# Altium project Safety.PrjPCB
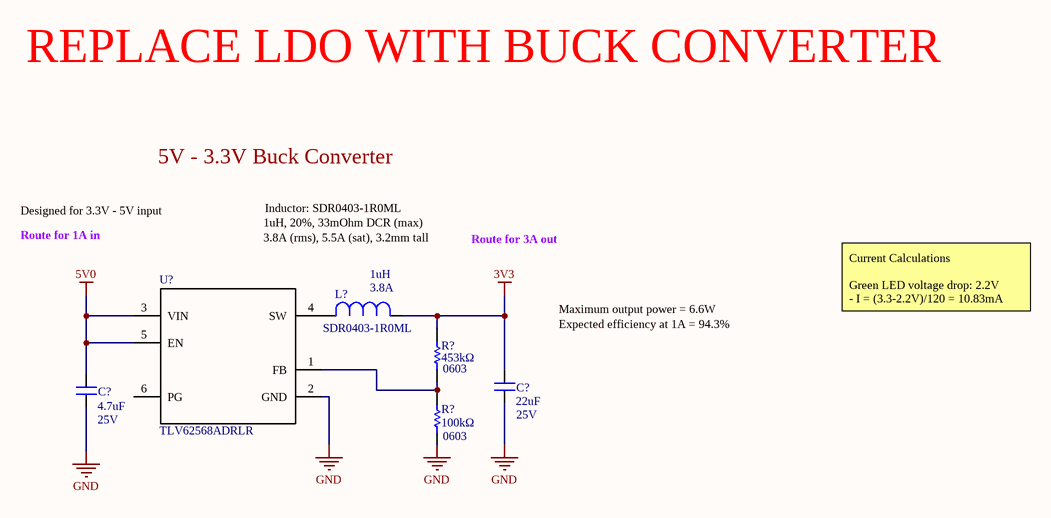
[diagram p0: SH1 - POWER.SchDoc]
Address1: 200 University Avenue; Address2: Waterloo; Address3: Ontario; Address4: Canada N2L 3G6; BoardName: Your Board Name; DrawnBy: Your Name
6 sheets, 103 parts. Net scope: flat (ports and power ports of the same name join across sheets).
Sheets:
  SH1 - POWER.SchDoc
  SH2 - CONNECTORS.SchDoc
  SH3 - OPAMPS.SchDoc
  SH4 - DIFFERENTIAL I2C.SchDoc
  SH5 - MICROCONTROLLER.SchDoc
  SH6 - CAN.SchDoc

## Sheet SH1 - POWER.SchDoc: Power
size Letter; DrawnBy: Qinyang Bao, Nicole Rosario; Organization: UW Robotics; Address1: 200 University Avenue; Address2: Waterloo; Address3: Ontario; Address4: Canada N2L 3G6

### Parts
(Parts that share a designator on the sheet are numbered #1, #2 ... from top to bottom, then left to right.)
C?#1  Voltage: 25V  Capacitance: 22uF  [CAPC3225X270N]  (hidden comment: GRM32ER71E226ME15K)
C?#2  value 4.7uF  Voltage Rating: 25V  [CAPC3225X280N]  (hidden comment: CAP_4.7uF_25V_1210)
L?  value 1uH  Manufacturer Part Number 1: SDR0403-1R0ML  Current Rating: 3.8A  [IND_BOURNS_SDR04]  (hidden comment: IND_1uH_3.8A)
R?#1  value 453kΩ  Package: 0603  [RESC0603(1608)_N]  (hidden comment: RES_453kΩ_0603)
R?#2  value 100kΩ  Package: 0603  [RESC0603(1608)_N]  (hidden comment: RES_100kΩ_0603_1%)
U?#1  TLV62568ADRLR  [SOT50P160X60-6N]

### Nets
3V3: C?#1.2 L?.2 R?#1.2
5V0: C?#2.2 U?#1.3(VIN) U?#1.5(EN)
GND: C?#1.1 C?#2.1 R?#2.1 U?#1.2(GND)
NetL?_1: L?.1 U?#1.4(SW)
NetR?#1_1: R?#1.1 R?#2.2 U?#1.1(FB)

Not connected (* = marked no-connect by the designer): U?#1 6(PG)

### Notes on the sheet
- REPLACE LDO WITH BUCK CONVERTER
- 5V - 3.3V Buck Converter
- Designed for 3.3V - 5V input
- Route for 1A in
- 1uH, 20%, 33mOhm DCR (max)
- 3.8A (rms), 5.5A (sat), 3.2mm tall
- Inductor: SDR0403-1R0ML
- Route for 3A out
- Current Calculations
  Green LED voltage drop: 2.2V
  - I = (3.3-2.2V)/120 = 10.83mA
- Maximum output power = 6.6W
- Expected efficiency at 1A = 94.3%
- Title
- Size:
- Date:
- Letter
- Drawn By:
- Sheet
- of
- File:

### Library data of the parts
C?#1 = GRM32ER71E226ME15K: CAP CER 22UF 25V X7R 1210; Manufacturer 1: Murata Electronics; Tolerance: ±20%; Manufacturer Part Number 1: GRM32ER71E226ME15K; Supplier 1: Digi-Key; Supplier Part Number 1: 490-14682-1-ND; Package: 1210 (3225 Metric)
C?#2 = CAP_4.7uF_25V_1210: CAP CER 4.7UF 25V X8L 1210; Manufacturer Part Number 1: GCJ32EL81E475KA01L; Manufacturer 1: Murata Electronics; Tolerance: 10%; Supplier Part Number 1: 490-16465-1-ND; Supplier 1: Digi-Key; Mount: Surface Mount; Case/Package: 1210; Case Code (Metric): 3225; Case Code (Imperial): 1210; Min Operating Temperature: -55°C; Max Operating Temperature: 150°C; Capacitance: 4.7uF
L? = IND_1uH_3.8A: FIXED IND 1UH 3.8A 33 MOHM SMD; Manufacturer 1: Bourns Inc.; Tolerance: ±20%; Supplier Part Number 1: SDR0403-1R0MLCT-ND; Supplier 1: Digi-Key
R?#1 = RES_453kΩ_0603: RES SMD 453K OHM 1% 1/10W 0603; Manufacturer 1: Panasonic Electronic Components; Manufacturer Part Number 1: ERJ-3EKF4533V; Dimensions: 0.063" L x 0.031" W (1.60mm x 0.80mm); Supplier Part Number 1: P453KHCT-ND; Supplier 1: Digi-Key; Mount: Surface Mount; Case Code (Metric): 1608; Tolerance: 1%; Case/Package: 0603
R?#2 = RES_100kΩ_0603_1%: RES SMD 100K OHM 1% 1/10W 0603; Manufacturer 1: Yageo; Manufacturer Part Number 1: RC0603FR-07100KL; Dimensions: 0.063" L x 0.031" W (1.60mm x 0.80mm); Supplier Part Number 1: 311-100KHRCT-ND; Supplier 1: Digi-Key; Mount: Surface Mount; Case Code (Metric): 1608; Tolerance: 1%; Case/Package: 0603
U?#1 = TLV62568ADRLR: IC REG BUCK ADJUSTABLE 2A SOT563; Manufacturer 1: Texas Instruments; Vin (Min): 2.5V; Vin (Max): 5.5V; Vout (Min/Fixed): 0.6V; Iout: 1A; Switching Frequency: 1.5MHz; Manufacturer Part Number 1: TLV62568ADRLR; Supplier 1: Digi-Key; Supplier Part Number 1: 296-50407-1-ND; Vout (Max): 5.5V; Package: SOT-563, SOT-666; Iout (Max): 2A

## Sheet SH2 - CONNECTORS.SchDoc: Connectors
size Letter; DrawnBy: Qinyang Bao, Nicole Rosario; Organization: UW Robotics; Address1: 200 University Avenue; Address2: Waterloo; Address3: Ontario; Address4: Canada N2L 3G6
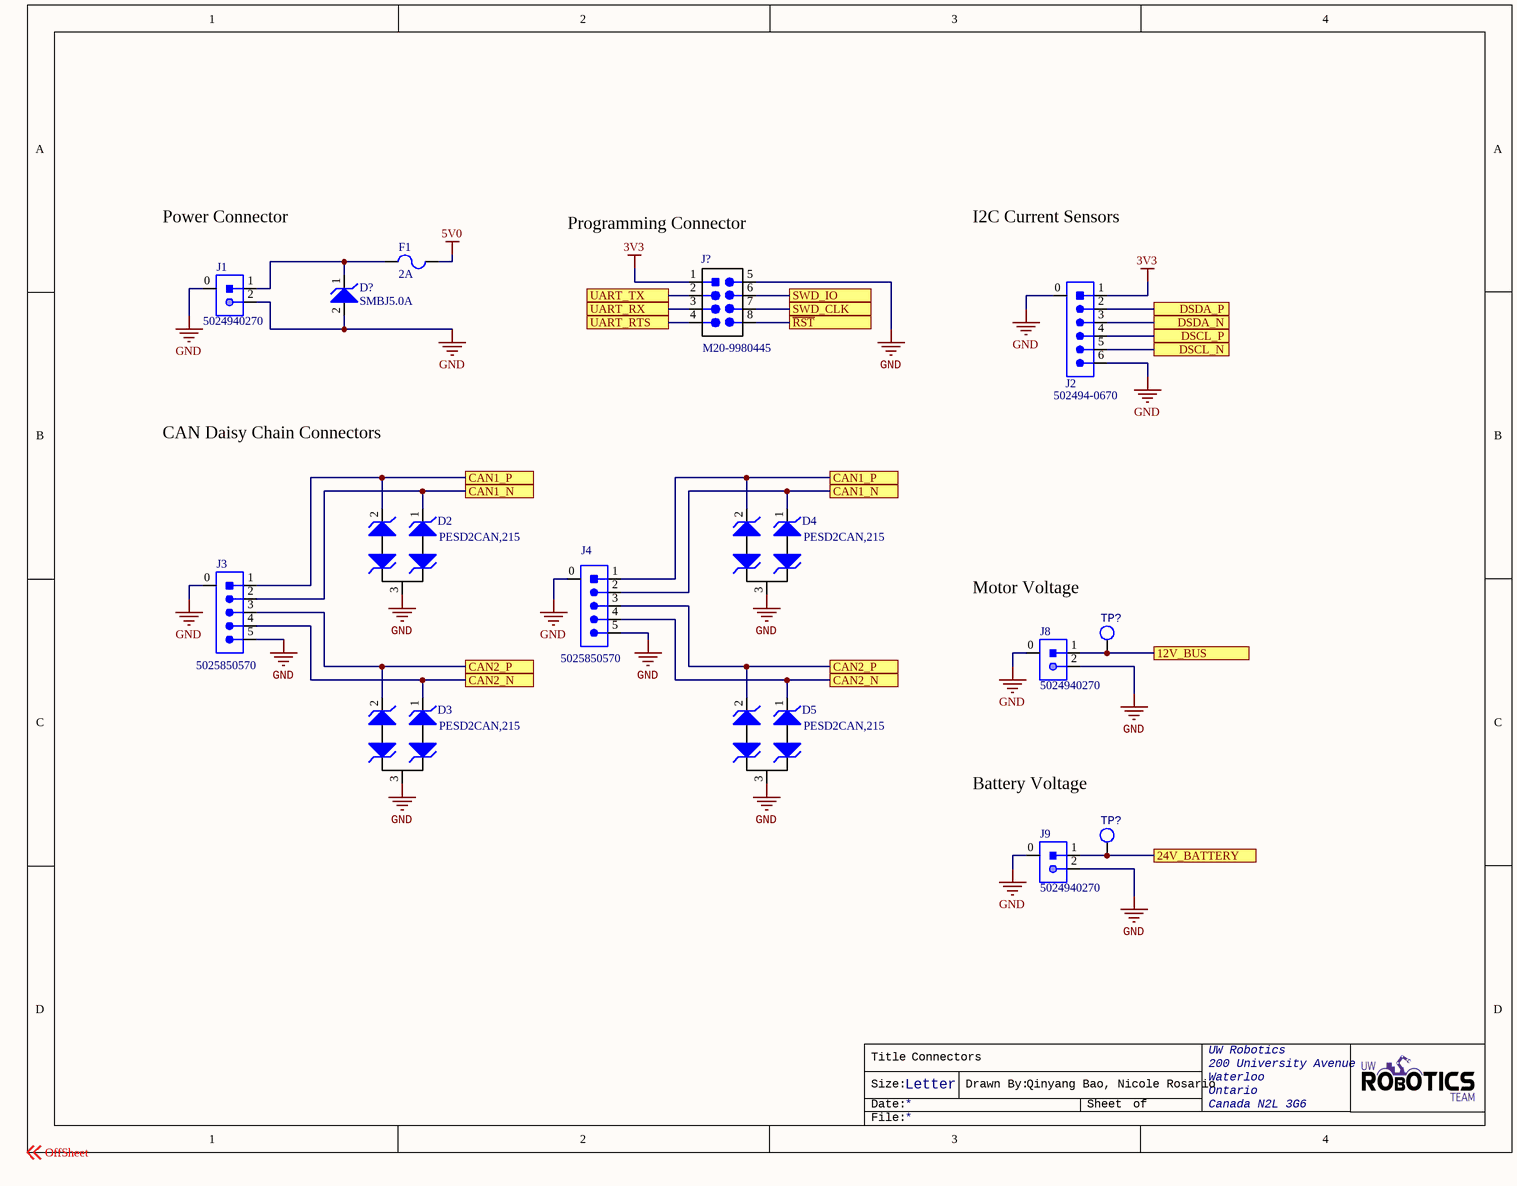
[diagram p1: SH2 - CONNECTORS.SchDoc]

### Parts
(Parts that share a designator on the sheet are numbered #1, #2 ... from top to bottom, then left to right.)
D2  Manufacturer Part Number: PESD2CAN,215  [NXP-SOT323-3]  (hidden comment: TVS_DIODE_CAN)
D3  Manufacturer Part Number: PESD2CAN,215  [NXP-SOT323-3]  (hidden comment: TVS_DIODE_CAN)
D4  Manufacturer Part Number: PESD2CAN,215  [NXP-SOT323-3]  (hidden comment: TVS_DIODE_CAN)
D5  Manufacturer Part Number: PESD2CAN,215  [NXP-SOT323-3]  (hidden comment: TVS_DIODE_CAN)
D?  Manufacturer Part Number 1: SMBJ5.0A  [TVS_DIODE_BIDIRECTIONAL]  (hidden comment: TVS_DIODE_UNIDIR_5V)
F1  Current Rating: 2A  [FUSE_0603]  (hidden comment: FUSE_2A_0603)
J1  Manufacturer Part Number 1: 5024940270  [MOLEX-5024940270]
J2  Manufacturer Part Number 1: 502494-0670  [MOLEX-5024940670]
J3  Manufacturer Part Number 1: 5025850570  [MOLEX-5025850570]
J4  Manufacturer Part Number 1: 5025850570  [MOLEX-5025850570]
J8  Manufacturer Part Number 1: 5024940270  [MOLEX-5024940270]
J9  Manufacturer Part Number 1: 5024940270  [MOLEX-5024940270]
J?  Manufacturer Part Number 1: M20-9980445  [HEADER_2X4]  (hidden comment: HEADER 4X2)
TP?#1  TESTPOINT_LOOP  [TESTPOINT_LOOP]  (value not drawn)
TP?#2  TESTPOINT_LOOP  [TESTPOINT_LOOP]  (value not drawn)

### Ports
12V_BUS, 24V_BATTERY, CAN1_N, CAN1_P, CAN2_N, CAN2_P, DSCL_N, DSCL_P, DSDA_N, DSDA_P, SWD_CLK, SWD_IO, UART_RTS, UART_RX, UART_TX, ~{RST}

### Nets
3V3: J2.1 J?.1(VCC)
5V0: F1.2
GND: D2.3 D3.3 D4.3 D5.3 D?.2 J1.0 J1.2 J2.0 J2.6 J3.0 J3.5 J4.0 J4.5 J8.0 J8.2 J9.0 J9.2 J?.5(GND)
BIAS_GND: J2.3 ; port DSDA_N
DSCL_N: J2.5 ; port DSCL_N
DSCL_P: J2.4 ; port DSCL_P
DSDA_P: J2.2 ; port DSDA_P
NetC5_2: J?.8 ; port ~{RST}
NetC?#3_2: D2.1 D4.1 J3.2 J4.2 ; port CAN1_N
NetC?#4_2: D2.2 D4.2 J3.1 J4.1 ; port CAN1_P
NetC?#6_2: D3.1 D5.1 J3.4 J4.4 ; port CAN2_N
NetC?#7_2: D3.2 D5.2 J3.3 J4.3 ; port CAN2_P
NetD?_1: D?.1 F1.1 J1.1
NetJ8_1: J8.1 TP?#1.1 ; port 12V_BUS
NetJ9_1: J9.1 TP?#2.1 ; port 24V_BATTERY
NetJ?_2: J?.2 ; port UART_TX
NetJ?_3: J?.3 ; port UART_RX
NetJ?_4: J?.4 ; port UART_RTS
NetJ?_6: J?.6 ; port SWD_IO
NetJ?_7: J?.7 ; port SWD_CLK

### Notes on the sheet
- Power Connector
- (near J?) Programming Connector
- I2C Current Sensors
- CAN Daisy Chain Connectors
- Motor Voltage
- Battery Voltage
- Labels drawn without touching a wire or pin: OffSheet
- Title
- Size:
- Date:
- Letter
- Drawn By:
- Sheet
- of
- File:

### Library data of the parts
D2-D5 = TVS_DIODE_CAN: TVS DIODE 24V 41V SOT323-3; Manufacturer: Nexperia USA Inc.; Package: SC-70, SOT-323; ComponentLink1Description: Datasheet; ComponentLink1URL: https://assets.nexperia.com/documents/data-sheet/PESD1CAN-U.pdf; Supplier Part Number 1: 1727-3891-1-ND; Supplier 1: Digi-Key
D? = TVS_DIODE_UNIDIR_5V: TVS DIODE 5V 9.2V DO214AA; Manufacturer 1: Littelfuse; Max Power Dissipation: 600W; Polarity: Unidirectional; Number of Elements: 1; Leakage Current: 800uA; Reverse Breakdown Voltage: 6.4V; Max Surge Current: 65.3A; Max Breakdown Voltage: 7V; Test Current: 10mA; Element Configuration: Single; Power Line Protection: No; Current: 68A; ESD Protection: Yes; ComponentLink1Description: Datasheet; ComponentLink1URL: https://www.littelfuse.com/~/media/electronics/datasheets/tvs_diodes/littelfuse_tvs_diode_smbj_datasheet.pdf.pdf; Supplier 1: Digi-Key; Stock 1: 14825; Pricing 1: 1=0.41000, 10=0.30500, 25=0.27520, 100=0.14500, 250=0.14352, 500=0.12850, 1000=0.10000 (USD); RoHS: Yes; Mount: Surface Mount; Case/Package: SMB; Number of Pins: 2; Min Operating Temperature: -55°C; Max Operating Temperature: 150°C; Packaging: Tape and Reel; Package Quantity: 3000; Power Dissipation: 600W; Direction: Unidirectional; Reverse Standoff Voltage: 5V; Min Breakdown Voltage: 6.4V; Clamping Voltage: 9.2V; Peak Pulse Power: 600W; Breakdown Voltage: 6.4V; Termination: SMD/SMT; Peak Pulse Current: 65.3A; Number of Channels: 1; Max Reverse Leakage Current: 800uA; Operating Supply Voltage: 5V; Number of Unidirectional Channels: 1; Composition: Zener; Voltage Rating (DC): 5V; Voltage: 5V; Length: 0.179inch; Height: 0.096inch; Width: 0.155inch; Radiation Hardening: No; REACH SVHC: Unknown; Lead Free: Lead Free; ComponentLink2URL: https://datasheet.ciiva.com/25624/0900766b810f4eeb-25624712.pdf?src-supplier=RSComponents; ComponentLink2Description: https://datasheet.ciiva.com/25624/0900766b810f4eeb-25624712.pdf?src-supplier=RSComponents; ComponentLink3URL: https://datasheet.ciiva.com/34302/1546929-34302459.pdf?src-supplier=Jameco; ComponentLink3Description: https://datasheet.ciiva.com/34302/1546929-34302459.pdf?src-supplier=Jameco; ComponentLink4URL: https://datasheet.ciiva.com/46381/1677318-46381958.pdf?src-supplier=Element14; ComponentLink4Description: https://datasheet.ciiva.com/46381/1677318-46381958.pdf?src-supplier=Element14; ComponentLink5URL: https://datasheet.ciiva.com/331/littelfuse-tvs-diode-smbj-datasheet-pdf-331131.pdf?src-supplier=Digi-Key; ComponentLink5Description: https://datasheet.ciiva.com/331/littelfuse-tvs-diode-smbj-datasheet-pdf-331131.pdf?src-supplier=Digi-Key; ComponentLink6URL: https://datasheet.ciiva.com/331/littelfuse-tvs-diode-smbj-datasheet-pdf-331132.pdf?src-supplier=Digi-Key; ComponentLink6Description: https://datasheet.ciiva.com/331/littelfuse-tvs-diode-smbj-datasheet-pdf-331132.pdf?src-supplier=Digi-Key; ComponentLink7URL: https://datasheet.ciiva.com/331/littelfuse-tvs-diode-smbj-datasheet-pdf-331133.pdf?src-supplier=Digi-Key; ComponentLink7Description: https://datasheet.ciiva.com/331/littelfuse-tvs-diode-smbj-datasheet-pdf-331133.pdf?src-supplier=Digi-Key; Supplier Part Number 1: SMBJ5.0ALFCT-ND
F1 = FUSE_2A_0603: FUSE SMD 2A 32V; ComponentLink1URL: https://datasheet.ciiva.com/303/467-303400.pdf?src-supplier=Digi-Key; ComponentLink1Description: https://datasheet.ciiva.com/303/467-303400.pdf?src-supplier=Digi-Key; ComponentLink2URL: http://datasheet.octopart.com/0467002.NRHF-Littelfuse-datasheet-32023482.pdf?src-supplier=Future+Electronics; ComponentLink2Description: http://datasheet.octopart.com/0467002.NRHF-Littelfuse-datasheet-32023482.pdf?src-supplier=Future+Electronics; ComponentLink3URL: http://datasheet.octopart.com/0467002.NRHF-Littelfuse-datasheet-136509808.pdf?src-supplier=Future+Electronics; ComponentLink3Description: http://datasheet.octopart.com/0467002.NRHF-Littelfuse-datasheet-136509808.pdf?src-supplier=Future+Electronics; Mount: Surface Mount; Voltage Rating (AC): 32V; Voltage Rating (DC): 32V; Supplier 1: Digi-Key; Supplier Part Number 1: F7132CT-ND; Supplier Packaging 1: Cut Tape
J1 J8 J9 = CON_2M_SM_RA: CONN HEADER SMD RIGHT ANGLE 2MM PITCH; Manufacturer 1: Molex; Connector Type: Receptacle,Forked; Number of Positions: 2; Supplier 1: Digi-Key; Stock 1: 3397; Pricing 1: 1=0.53000, 10=0.49400, 25=0.44440, 50=0.39500, 100=0.37850, 250=0.34556 (USD); RoHS: No; Mount: Surface Mount; Contact Plating: Tin; Insulation Color: Natural; Insulation Material: Resin; Min Operating Temperature: -40°C; Max Operating Temperature: 105°C; Fastening Type: Latch; Packaging: Tape and Reel; Number of Rows: 1; Termination: Solder; Flammability Rating: UL94 V-0; ComponentLink1URL: https://www.molex.com/pdm_docs/as/AS-502439-002-001.pdf?src-supplier=Digi-Key; ComponentLink1Description: https://www.molex.com/pdm_docs/as/AS-502439-002-001.pdf?src-supplier=Digi-Key; Supplier Part Number 1: WM15810CT-ND
J2 = CON_6M_SM_RA: CONN HEADER SMD RIGHT ANGLE 2MM PITCH; Manufacturer 1: Molex; Insulation Resistance: 1GR; Current Rating: 3A; Voltage Rating: 250V; Connector Type: Receptacle,Forked; Number of Positions: 6; Gender: Receptacle; Glow Wire Compliant: Non-compliant; Supplier 1: Digi-Key; Stock 1: 7093; Pricing 1: 1=0.81000, 10=0.70800, 25=0.66680, 50=0.63880, 100=0.61110, 250=0.55552 (USD); RoHS: Yes; Mount: Surface Mount; Material: Polybutylene; Color: Natural; Housing Material: PBT; Housing Color: Natural; Contact Plating: Tin; Contact Material: Copper Alloy; Min Operating Temperature: -25°C; Max Operating Temperature: 85°C; Package Quantity: 950; Number of Rows: 1; Fastening Type: Latch; Packaging: Tape and Reel; Termination: Solder; Number of Contacts: 6; Orientation: Right Angle; Number of Circuits: 6; Contact Gender: Female; Max Voltage Rating (AC): 250V; Max Voltage Rating (DC): 250V; Length: 16mm; Pitch: 2mm; Depth: 6.85mm; Radiation Hardening: No; REACH SVHC: Unknown; Flammability Rating: UL94 V-0; ComponentLink1URL: https://datasheet.ciiva.com/755/5024940670-sd-755844.pdf?src-supplier=Digi-Key; ComponentLink1Description: https://datasheet.ciiva.com/755/5024940670-sd-755844.pdf?src-supplier=Digi-Key; ComponentLink2URL: https://datasheet.ciiva.com/24467/101355024940670-pcb-receptacles-24467588.pdf?src-supplier=Onlinecomponents.com; ComponentLink2Description: https://datasheet.ciiva.com/24467/101355024940670-pcb-receptacles-24467588.pdf?src-supplier=Onlinecomponents.com; ComponentLink3URL: https://datasheet.ciiva.com/16656/5024940670-pcb-receptacles-16656439.pdf?src-supplier=Avnet+Europe; ComponentLink3Description: https://datasheet.ciiva.com/16656/5024940670-pcb-receptacles-16656439.pdf?src-supplier=Avnet+Europe; ComponentLink4URL: https://datasheet.ciiva.com/7436/1630854-7436283.pdf?src-supplier=Newark; ComponentLink4Description: https://datasheet.ciiva.com/7436/1630854-7436283.pdf?src-supplier=Newark; ComponentLink5URL: https://datasheet.ciiva.com/5157/5024940670-pcb-receptacles-179322-5157180.pdf?src-supplier=Mouser; ComponentLink5Description: https://datasheet.ciiva.com/5157/5024940670-pcb-receptacles-179322-5157180.pdf?src-supplier=Mouser; ComponentLink6URL: https://datasheet.ciiva.com/7917/1630854-7917014.pdf?src-supplier=Element14; ComponentLink6Description: https://datasheet.ciiva.com/7917/1630854-7917014.pdf?src-supplier=Element14; ComponentLink7URL: https://datasheet.ciiva.com/30242/101355024940670-pcb-receptacles-30242550.pdf?src-supplier=Onlinecomponents.com; ComponentLink7Description: https://datasheet.ciiva.com/30242/101355024940670-pcb-receptacles-30242550.pdf?src-supplier=Onlinecomponents.com; ComponentLink8URL: https://datasheet.ciiva.com/755/5024940670-sd-755789.pdf?src-supplier=Digi-Key; ComponentLink8Description: https://datasheet.ciiva.com/755/5024940670-sd-755789.pdf?src-supplier=Digi-Key; Supplier Part Number 1: WM2283CT-ND
J3 J4 = CON_5M_SM_RA: CONN HEADER SMD RIGHT ANGLE 1.5MM PITCH; Manufacturer 1: Molex; Connector Type: Receptacle,Center Strip Contact; Number of Positions: 5; Current Rating: 2A; Supplier 1: Digi-Key; Stock 1: 2875; RoHS: Yes; Mount: Surface Mount; Termination: Solder; Number of Contacts: 5; Orientation: Right Angle; Number of Circuits: 5; Number of Rows: 1; Supplier Part Number 1: WM14469CT-ND
J? = HEADER 4X2: CONN HEADER VERT 8POS 2.54MM; Manufacturer 1: Harwin Inc.; Supplier Part Number 1: 952-2122-ND; Supplier 1: Digi-Key
TP?#1 TP?#2 = TESTPOINT_LOOP: Loop testpoint through-hole pad; Manufacturer: Keystone Electronics; Manufacturer Part Number 1: 5002; Supplier Part Number 1: 36-5002-ND; Supplier 1: Digi-Key

## Sheet SH3 - OPAMPS.SchDoc: Safety - Opamps
size Letter; DrawnBy: Qinyang Bao, Kyle Hong; Organization: UW Robotics; Address1: 200 University Avenue; Address2: Waterloo; Address3: Ontario; Address4: Canada N2L 3G6
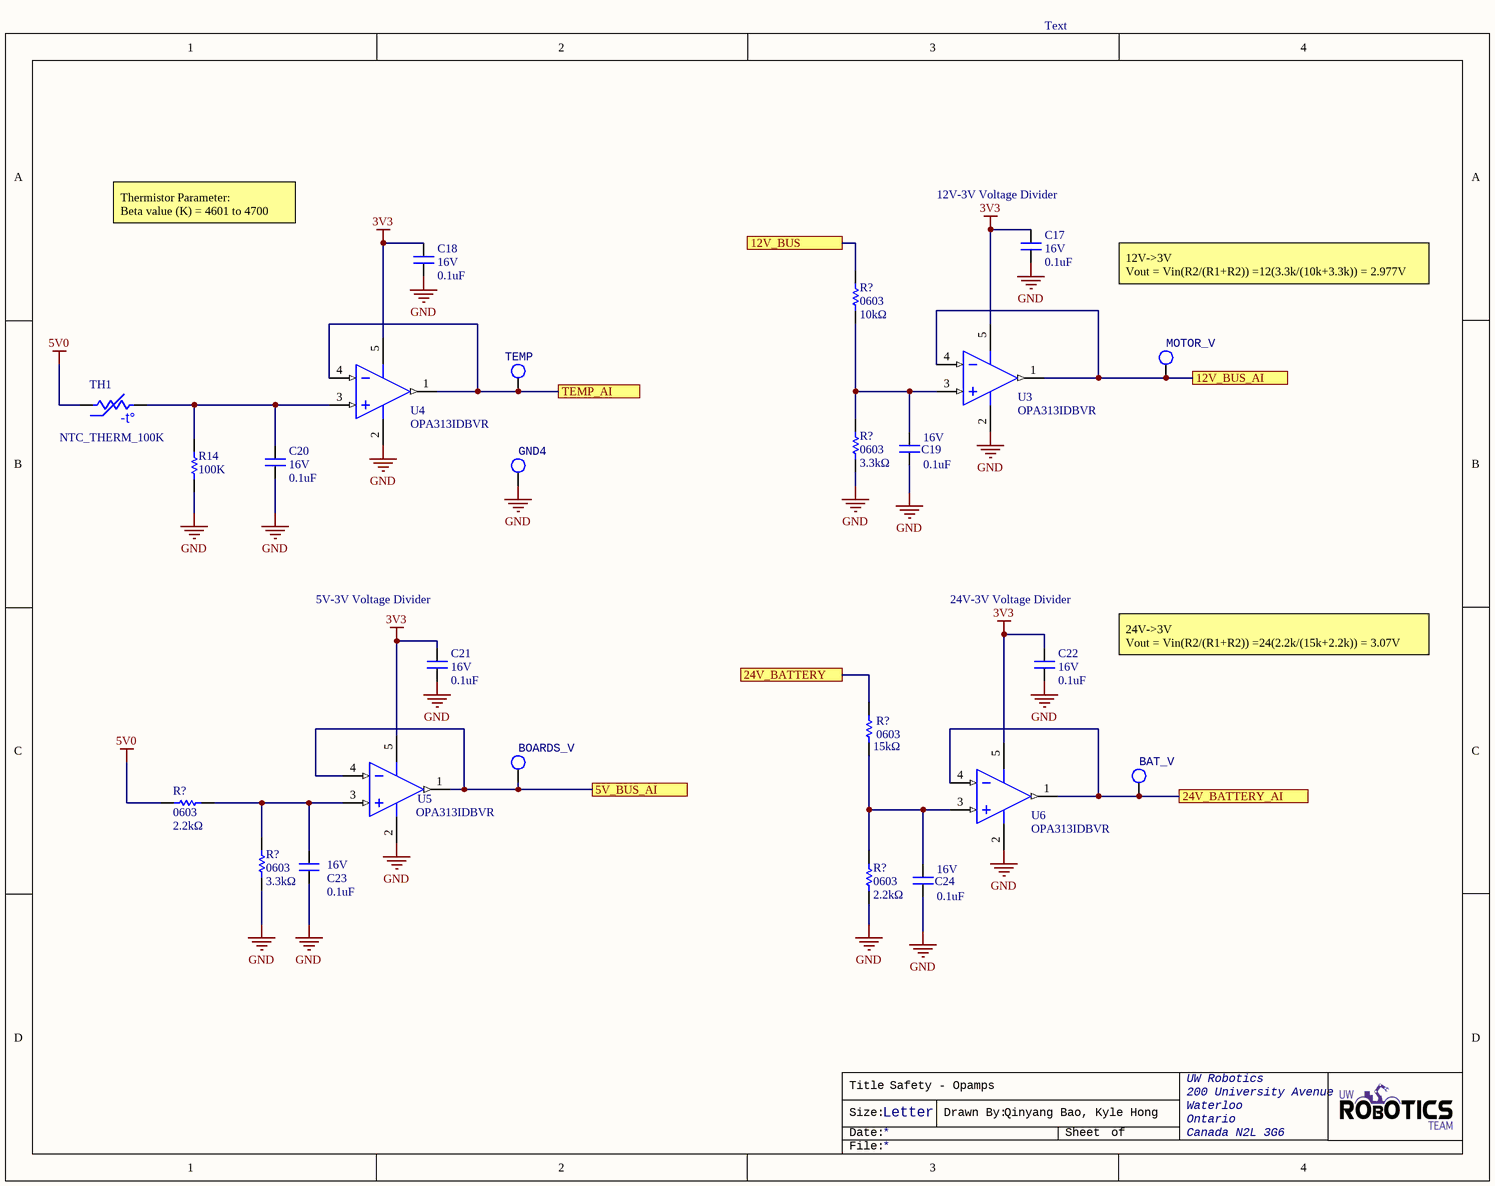
[diagram p2: SH3 - OPAMPS.SchDoc]

### Parts
(Parts that share a designator on the sheet are numbered #1, #2 ... from top to bottom, then left to right.)
BAT_V  TESTPOINT_LOOP  [TESTPOINT_LOOP]  (value not drawn)
BOARDS_V  TESTPOINT_LOOP  [TESTPOINT_LOOP]  (value not drawn)
C17  value 0.1uF  Voltage Rating: 16V  [CAPC0603(1608)55_N]  (hidden comment: CAP_0.1uF_16V_0603)
C18  value 0.1uF  Voltage Rating: 16V  [CAPC0603(1608)55_N]  (hidden comment: CAP_0.1uF_16V_0603)
C19  value 0.1uF  Voltage Rating: 16V  [CAPC0603(1608)55_N]  (hidden comment: CAP_0.1uF_16V_0603)
C20  value 0.1uF  Voltage Rating: 16V  [CAPC0603(1608)55_N]  (hidden comment: CAP_0.1uF_16V_0603)
C21  value 0.1uF  Voltage Rating: 16V  [CAPC0603(1608)55_N]  (hidden comment: CAP_0.1uF_16V_0603)
C22  value 0.1uF  Voltage Rating: 16V  [CAPC0603(1608)55_N]  (hidden comment: CAP_0.1uF_16V_0603)
C23  value 0.1uF  Voltage Rating: 16V  [CAPC0603(1608)55_N]  (hidden comment: CAP_0.1uF_16V_0603)
C24  value 0.1uF  Voltage Rating: 16V  [CAPC0603(1608)55_N]  (hidden comment: CAP_0.1uF_16V_0603)
GND4  TESTPOINT_LOOP  [TESTPOINT_LOOP]  (value not drawn)
MOTOR_V  TESTPOINT_LOOP  [TESTPOINT_LOOP]  (value not drawn)
R14  value 100K  [RESC0603(1608)_N]  (hidden comment: RES_100K_0603)
R?#3  value 10kΩ  Case Code (Imperial): 0603  [RESC0603(1608)_N]  (hidden comment: RES_10kΩ_0603)
R?#4  value 3.3kΩ  Case Code (Imperial): 0603  [RESC0603(1608)_N]  (hidden comment: RES_3.3kΩ_0603)
R?#5  value 15kΩ  Case Code (Imperial): 0603  [RESC0603(1608)_N]  (hidden comment: RES_15kΩ_0603)
R?#6  value 2.2kΩ  Case Code (Imperial): 0603  [RESC0603(1608)_N]  (hidden comment: RES_2.2kΩ_0603)
R?#7  value 3.3kΩ  Case Code (Imperial): 0603  [RESC0603(1608)_N]  (hidden comment: RES_3.3kΩ_0603)
R?#8  value 2.2kΩ  Case Code (Imperial): 0603  [RESC0603(1608)_N]  (hidden comment: RES_2.2kΩ_0603)
TEMP  TESTPOINT_LOOP  [TESTPOINT_LOOP]  (value not drawn)
TH1  NTC_THERM_100K  [RESC0603(1608)_N]
U3  OPA313IDBVR  [DBV0005A_M]
U4  OPA313IDBVR  [DBV0005A_M]
U5  OPA313IDBVR  [DBV0005A_M]
U6  OPA313IDBVR  [DBV0005A_M]

### Ports
5V_BUS_AI, 12V_BUS, 12V_BUS_AI, 24V_BATTERY, 24V_BATTERY_AI, TEMP_AI

### Nets
3V3: C17.2 C18.1 C21.2 C22.2 U3.5(V+) U4.5(V+) U5.5(V+) U6.5(V+)
5V0: R?#6.1 TH1.2
GND: C17.1 C18.2 C19.1 C20.1 C21.1 C22.1 C23.1 C24.1 GND4.1 R14.1 R?#4.1 R?#7.1 R?#8.2 U3.2(V-) U4.2(V-) U5.2(V-) U6.2(V-)
NetBAT_V_1: BAT_V.1 U6.1(OUT) U6.4(IN-) ; port 24V_BATTERY_AI
NetBOARDS_V_1: BOARDS_V.1 U5.1(OUT) U5.4(IN-) ; port 5V_BUS_AI
NetC19_2: C19.2 R?#3.1 R?#4.2 U3.3(IN+)
NetC20_2: C20.2 R14.2 TH1.1 U4.3(IN+)
NetC23_2: C23.2 R?#6.2 R?#7.2 U5.3(IN+)
NetC24_2: C24.2 R?#5.1 R?#8.1 U6.3(IN+)
NetJ8_1: R?#3.2 ; port 12V_BUS
NetJ9_1: R?#5.2 ; port 24V_BATTERY
NetMOTOR_V_1: MOTOR_V.1 U3.1(OUT) U3.4(IN-) ; port 12V_BUS_AI
NetSTM1_20: TEMP.1 U4.1(OUT) U4.4(IN-) ; port TEMP_AI

### Notes on the sheet
- Text
- Thermistor Parameter:
  Beta value (K) = 4601 to 4700
- (near C17) 12V-3V Voltage Divider
- 12V->3V
  Vout = Vin(R2/(R1+R2)) =12(3.3k/(10k+3.3k)) = 2.977V
- 5V-3V Voltage Divider
- 24V-3V Voltage Divider
- 24V->3V
  Vout = Vin(R2/(R1+R2)) =24(2.2k/(15k+2.2k)) = 3.07V
- Title
- Size:
- Date:
- Letter
- Drawn By:
- Sheet
- of
- File:
- (in symbol NTC_THERM_100K) -t°

### Library data of the parts
BAT_V BOARDS_V GND4 MOTOR_V TEMP = TESTPOINT_LOOP: as TP?#1 on sheet SH2 - CONNECTORS; Supplier Part Number 1: 36-5002-ND; Supplier 1: Digi-Key
C17-C24 = CAP_0.1uF_16V_0603: CAP CER 0.1UF 16V X7R 0603; MPN: CC0603KRX7R7BB104; Manufacturer: Yageo; Dimensions: 0.063" L x 0.031" W (1.60mm x 0.80mm); Package: 0603 (1608 Metric); Temperature Coefficient: X7R; Supplier Part Number 1: 311-1088-1-ND; Supplier 1: Digi-Key
R14 = RES_100K_0603: RES SMD 100K OHM 5% 1/10W 0603; Manufacturer: Yageo; MPN: RC0603FR-07261KL; Dimensions: 0.063" L x 0.031" W (1.60mm x 0.80mm); Tolerance: 5%; Package: 0603 (1608 Metric); Supplier Part Number 1: 311-261KHRCT-ND; Supplier 1: Digi-Key
R?#3 = RES_10kΩ_0603: RES SMD 10K OHM 5% 1/10W 0603; Manufacturer 1: Yageo; Manufacturer Part Number 1: RC0603JR-0710KL; Package: 0603 (1608 Metric); Dimensions: 0.063" L x 0.031" W (1.60mm x 0.80mm); Supplier Part Number 1: 311-10KGRCT-ND; Supplier 1: Digi-Key; Mount: Surface Mount; Case Code (Metric): 1608; Tolerance: 5%
R?#4 R?#7 = RES_3.3kΩ_0603: RES SMD 3.3K OHM 5% 1/10W 0603; Manufacturer 1: Yageo; Manufacturer Part Number 1: RC0603JR-073K3L; Dimensions: 0.063" L x 0.031" W (1.60mm x 0.80mm); Package: 0603 (1608 Metric); Supplier 1: Digi-Key; Supplier Part Number 1: 311-3.3KGRCT-ND; Mount: Surface Mount; Case Code (Metric): 1608; Tolerance: 5%
R?#5 = RES_15kΩ_0603: RES SMD 15K OHM 5% 1/10W 0603; Manufacturer 1: Yageo; Manufacturer Part Number 1: RC0603JR-0715KL; Package: 0603 (1608 Metric); Dimensions: 0.063" L x 0.031" W (1.60mm x 0.80mm); Supplier Part Number 1: 311-15KGRCT-ND; Supplier 1: Digi-Key; Mount: Surface Mount; Case Code (Metric): 1608; Tolerance: 5%
R?#6 R?#8 = RES_2.2kΩ_0603: RES SMD 2.2K OHM 1% 1/10W 0603; Manufacturer 1: Yageo; Manufacturer Part Number 1: RC0603FR-072K2L; Dimensions: 0.063" L x 0.031" W (1.60mm x 0.80mm); Package: 0603 (1608 Metric); Supplier Part Number 1: 311-2.20KHRCT-ND; Supplier 1: Digi-Key; Mount: Surface Mount; Case Code (Metric): 1608; Tolerance: 1%
TH1 = NTC_THERM_100K: THERM NTC 100KOHM 4700K 0603; MPN: ERT-J1VV104J; Manufacturer: Panasonic; Value: 100K; Supplier Part Number 1: P10555CT-ND; Supplier 1: Digi-Key
U3-U6 = OPAMP: IC OPAMP GP 1 CIRCUIT SOT23-5; Manufacturer: Texas Instruments; Offset Drift(Typ)(uV/C): 2; Rating: Catalog; Packing: LARGE T&R; SubFamily: Low Input Bias Current Amp (<=10pA), Low Power Amp (<=500uA); Number of Channels: 1; Eco-Plan: Green (RoHS & no Sb/Br); Vio (25C)(Max)(mV): 2.5; Total Supply Voltage(Min)(+5V is 5, +/-5V is 10): 1.8; CMRR(Min)(dB): 70; Total Supply Voltage(Max)(+5V is 5, +/-5V is 10): 5.5; Iq per channel(Max)(mA): 0.06; Slew Rate(Typ)(V/us): 0.5; ComponentLink1Description: Manufacturer URL; PackageVersion: 4073253-4/K, 03/2006; ComponentLink2Description: Datasheet; Code_JEDEC: MO-178; GBW(Typ)(MHz): 1; ComponentLink3Description: Package Specification; PartNumber: OPA313IDBVR; PackageReference: DBV0005A; Mounting Technology: Surface Mount; PackageDescription: 5-Pin Plastic Small Outline, Body 1.6 x 2.9 mm, Pitch 0.95 mm; ComponentLink1URL: http://www.ti.com/; DatasheetVersion: SBOS649C; ComponentLink2URL: http://www.ti.com/lit/ds/symlink/opa313.pdf; ComponentLink3URL: http://www.ti.com/litv/pdf/mpds018i; Supplier Part Number 1: 296-35607-1-ND; Supplier 1: Digi-Key

## Sheet SH4 - DIFFERENTIAL I2C.SchDoc: Safety - Differential I2C
size Letter; DrawnBy: Ayesha Ebrahim; Organization: UW Robotics; Address1: 200 University Avenue; Address2: Waterloo; Address3: Ontario; Address4: Canada N2L 3G6
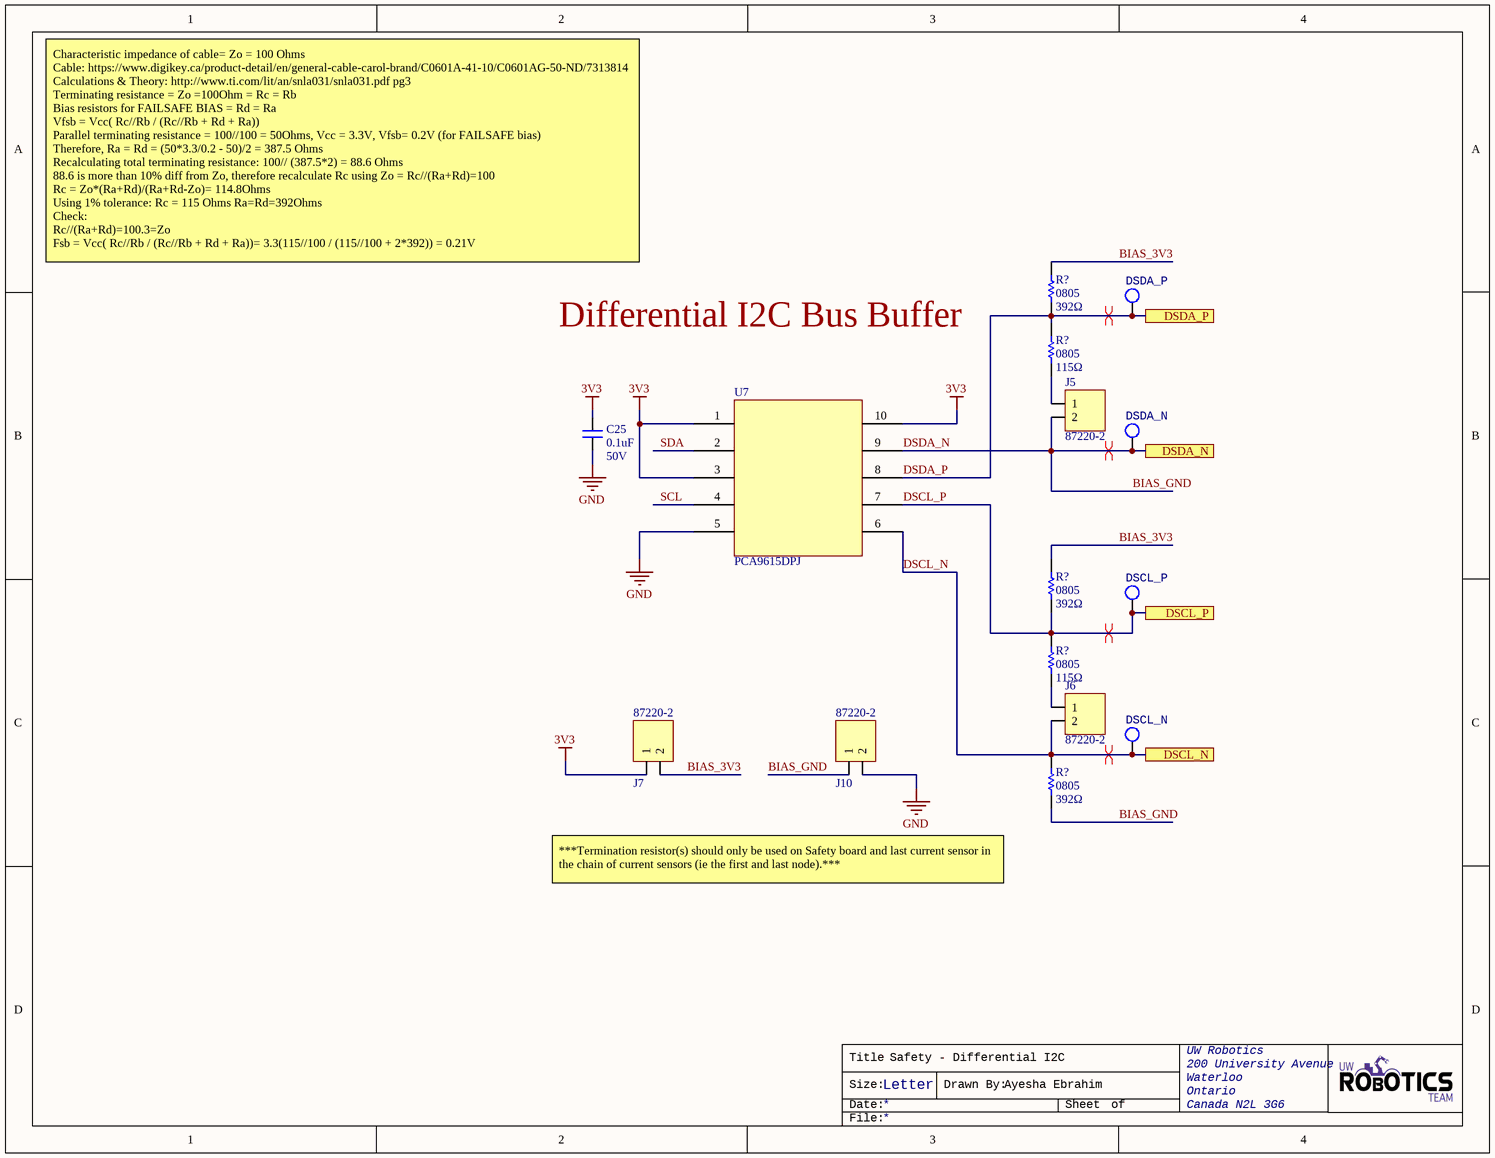
[diagram p3: SH4 - DIFFERENTIAL I2C.SchDoc]

### Parts
(Parts that share a designator on the sheet are numbered #1, #2 ... from top to bottom, then left to right.)
C25  value 0.1uF  Voltage Rating: 50V  [CAPC2012X140N]  (hidden comment: CAP_0.1uF_50V_0805)
J5  Manufacturer Part Number 1: 87220-2  [HDR1X2]  (hidden comment: JUMPER_2)
J6  Manufacturer Part Number 1: 87220-2  [HDR1X2]  (hidden comment: JUMPER_2)
J7  Manufacturer Part Number 1: 87220-2  [HDR1X2]  (hidden comment: JUMPER_2)
J10  Manufacturer Part Number 1: 87220-2  [HDR1X2]  (hidden comment: JUMPER_2)
R?#9  Case Code (Imperial): 0805  Resistance: 392Ω  [RESC2012X60N]  (hidden comment: RES_392Ω_0805)
R?#10  Case Code (Imperial): 0805  Resistance: 115Ω  [RESC2012X60N]  (hidden comment: RES_115Ω_0805)
R?#11  Case Code (Imperial): 0805  Resistance: 392Ω  [RESC2012X60N]  (hidden comment: RES_392Ω_0805)
R?#12  Case Code (Imperial): 0805  Resistance: 115Ω  [RESC2012X60N]  (hidden comment: RES_115Ω_0805)
R?#13  Case Code (Imperial): 0805  Resistance: 392Ω  [RESC2012X60N]  (hidden comment: RES_392Ω_0805)
TP1  DSDA_P  [TESTPOINT_LOOP]
TP2  DSDA_N  [TESTPOINT_LOOP]
TP3  DSCL_P  [TESTPOINT_LOOP]
TP4  DSCL_N  [TESTPOINT_LOOP]
U7  DIFF_I2C_BUFFER  [PCA9615DPJ]  (value not drawn)

### Ports
DSCL_N, DSCL_P, DSDA_N, DSDA_P

### Nets
3V3: C25.2 J7.1 U7.1(VDDA) U7.3(EN) U7.10(VDDB)
GND: C25.1 J10.2 U7.5(VSS)
BIAS_3V3: J7.2 R?#9.2 R?#11.2
BIAS_GND: J5.2 J10.1 R?#13.1 TP2.1 U7.9(DSDAM) ; port DSDA_N  [also labelled DSDA_N]
DSCL_N: J6.2 R?#13.2 TP4.1 U7.6(DSCLM) ; port DSCL_N
DSCL_P: R?#11.1 R?#12.2 TP3.1 U7.7(DSCLP) ; port DSCL_P
DSDA_P: R?#9.1 R?#10.2 TP1.1 U7.8(DSDAP) ; port DSDA_P
SCL: U7.4(SCL)
SDA: U7.2(SDA)
NetJ5_1: J5.1 R?#10.1
NetJ6_1: J6.1 R?#12.1

### Layout directives
differential pair: BIAS_GND, DSCL_N, DSCL_P, DSDA_P

### Notes on the sheet
- Characteristic impedance of cable= Zo = 100 Ohms
  Cable: https://www.digikey.ca/product-detail/en/general-cable-carol-brand/C0601A-41-10/C0601AG-50-ND/7313814
  Calculations & Theory: http://www.ti.com/lit/an/snla031/snla031.pdf pg3
  Terminating resistance = Zo =100Ohm = Rc = Rb
  Bias resistors for FAILSAFE BIAS = Rd = Ra
  Vfsb = Vcc( Rc//Rb / (Rc//Rb + Rd + Ra))
  Parallel terminating resistance = 100//100 = 50Ohms, Vcc = 3.3V, Vfsb= 0.2V (for FAILSAFE bias)
  Therefore, Ra = Rd = (50*3.3/0.2 - 50)/2 = 387.5 Ohms
  Recalculating total terminating resistance: 100// (387.5*2) = 88.6 Ohms
  88.6 is more than 10% diff from Zo, therefore recalculate Rc using Zo = Rc//(Ra+Rd)=100
  Rc = Zo*(Ra+Rd)/(Ra+Rd-Zo)= 114.8Ohms
  Using 1% tolerance: Rc = 115 Ohms Ra=Rd=392Ohms
  Check:
  Rc//(Ra+Rd)=100.3=Zo
  Fsb = Vcc( Rc//Rb / (Rc//Rb + Rd + Ra))= 3.3(115//100 / (115//100 + 2*392)) = 0.21V
- (near R?#9) Differential I2C Bus Buffer
- ***Termination resistor(s) should only be used on Safety board and last current sensor in the chain of current sensors (ie the first and last node).***
- Title
- Size:
- Date:
- Letter
- Drawn By:
- Sheet
- of
- File:

### Library data of the parts
C25 = CAP_0.1uF_50V_0805: CAP CER 0.1UF 50V X7R 0805; Manufacturer 1: Murata; Manufacturer Part Number 1: GCD21BR71H104KA01L; Capacitance: 100nF; Tolerance: 10%; Supplier 1: Digi-Key; Mount: Surface Mount; Case/Package: 0805; Case Code (Metric): 2012; Case Code (Imperial): 0805; Min Operating Temperature: -55°C; Max Operating Temperature: 125°C; Dielectric: X7R; Termination: SMD/SMT; Length: 2mm; Height: 1.25mm; Width: 0.049inch; Thickness: 0.049inch; Depth: 1.25mm; Ratings: AEC-Q200; ComponentLink1URL: https://datasheet.ciiva.com/29537/c03e-29537701.pdf?src-supplier=Digi-Key; ComponentLink1Description: https://datasheet.ciiva.com/29537/c03e-29537701.pdf?src-supplier=Digi-Key; Supplier Part Number 1: 490-11955-1-ND
J5-J7 J10 = JUMPER_2: HEADER 2X1; Manufacturer 1: TE Connectivity; Supplier 1: Digi-Key; Supplier Part Number 1: A26542-ND; Mount: Through Hole
R?#9 R?#11 R?#13 = RES_392Ω_0805: RES SMD 392 OHM 1% 1/8W 0805; Manufacturer 1: Yageo; Manufacturer Part Number 1: RC0805FR-07392RL; Max Power Dissipation: 125mW; Temperature Coefficient: 100ppm/°C; Voltage Rating (DC): 150V; Case Code (Metric): 2012; Category: Chip SMD Resistors; Composition: Thick Film; Depth: 1.25mm; Features: Moisture Resistant; Height: 0.024inch; Military Standard: Not; Max Operating Temperature: 155°C; Manufacturer Part Number: RC0805FR-07392RL; Length: 0.079inch; Min Operating Temperature: -55°C; Number of Terminations: 2; Power Rating: 125mW; Tolerance: 1%; Width: 0.049inch; Supplier 1: Digi-Key; Supplier Part Number 1: 311-392CRCT-ND; Supplier Packaging 1: Cut Tape; Supplier Unit Price 1: 0.15 CAD; Supplier Location 1: US; Package: 0805 (2012 Metric)
R?#10 R?#12 = RES_115Ω_0805: RES SMD 115 OHM 1% 1/8W 0805; Manufacturer 1: Yageo; Manufacturer Part Number 1: RC0805FR-07115RL; Max Power Dissipation: 125mW; Temperature Coefficient: 100ppm/°C; Voltage Rating (DC): 150V; Case Code (Metric): 2012; Category: Chip SMD Resistors; Composition: Thick Film; Depth: 1.25mm; Features: Moisture Resistant; Height: 0.024inch; Military Standard: Not; Max Operating Temperature: 155°C; Manufacturer Part Number: RC0805FR-07115RL; Length: 0.079inch; Min Operating Temperature: -55°C; Number of Terminations: 2; Power Rating: 125mW; Tolerance: 1%; Width: 0.049inch; Supplier 1: Digi-Key; Supplier Part Number 1: 311-115CRCT-ND; Supplier Packaging 1: Cut Tape; Supplier Unit Price 1: 0.14476 CAD; Supplier Location 1: US; Package: 0805 (2012 Metric)
TP1-TP4 = TESTPOINT_LOOP: Loop testpoint through-hole pad; Manufacturer 1: Keystone Electronics; Manufacturer Part Number 1: 5002; Supplier Part Number 1: 36-5002-ND; Supplier 1: Digi-Key; Mount: Through Hole
U7 = DIFF_I2C_BUFFER: IC DIFF I2C BUFFER 2CH 10TSSOP; Manufacturer 1: NXP Semiconductors; Number of Channels: 2; Operating Supply Current: 16uA; Input: 2-Wire Bus; Max Frequency: 1MHz; Supplier 1: Digi-Key; Stock 1: 4899; Pricing 1: 1=2.95000, 10=2.64900, 100=2.05930, 500=1.78100, 1000=1.48045 (USD); RoHS: Yes; Case/Package: 10-TSSOP; Number of Pins: 10; Min Operating Temperature: -40°C; Max Operating Temperature: 85°C; Packaging: Cut Tape; Package Quantity: 1; ComponentLink1URL: http://www.farnell.com/datasheets/2340284.pdf?src-supplier=Farnell; ComponentLink1Description: http://www.farnell.com/datasheets/2340284.pdf?src-supplier=Farnell; ComponentLink2URL: http://www.mouser.com/ds/2/302/PCA9615-841773.pdf?src-supplier=Mouser; ComponentLink2Description: http://www.mouser.com/ds/2/302/PCA9615-841773.pdf?src-supplier=Mouser; ComponentLink3URL: http://components.arrow.com/part/dataview/65281105S797392N7788?src-supplier=Arrow; ComponentLink3Description: http://components.arrow.com/part/dataview/65281105S797392N7788?src-supplier=Arrow; ComponentLink4URL: http://www.nxp.com/documents/data_sheet/PCA9615.pdf?src-supplier=Avnet; ComponentLink4Description: http://www.nxp.com/documents/data_sheet/PCA9615.pdf?src-supplier=Avnet; ComponentLink5Description: Digikey Link; ComponentLink5URL: https://www.digikey.ca/products/en/integrated-circuits-ics/interface-signal-buffers-repeaters-splitters/756?k=PCA9615&k=&pkeyword=PCA9615&sv=0&pv7=2&sf=0&FV=-8%7C756&quantity=&ColumnSort=0&page=1&pageSize=25; Supplier Part Number 1: 568-11484-1-ND; Mount: Surface Mount; Manufacturer Part Number 1: PCA9615DPJ

## Sheet SH5 - MICROCONTROLLER.SchDoc: MCU
size Letter; DrawnBy: Qinyang Bao, Nicole Rosario; Organization: UW Robotics; Address1: 200 University Avenue; Address2: Waterloo; Address3: Ontario; Address4: Canada N2L 3G6
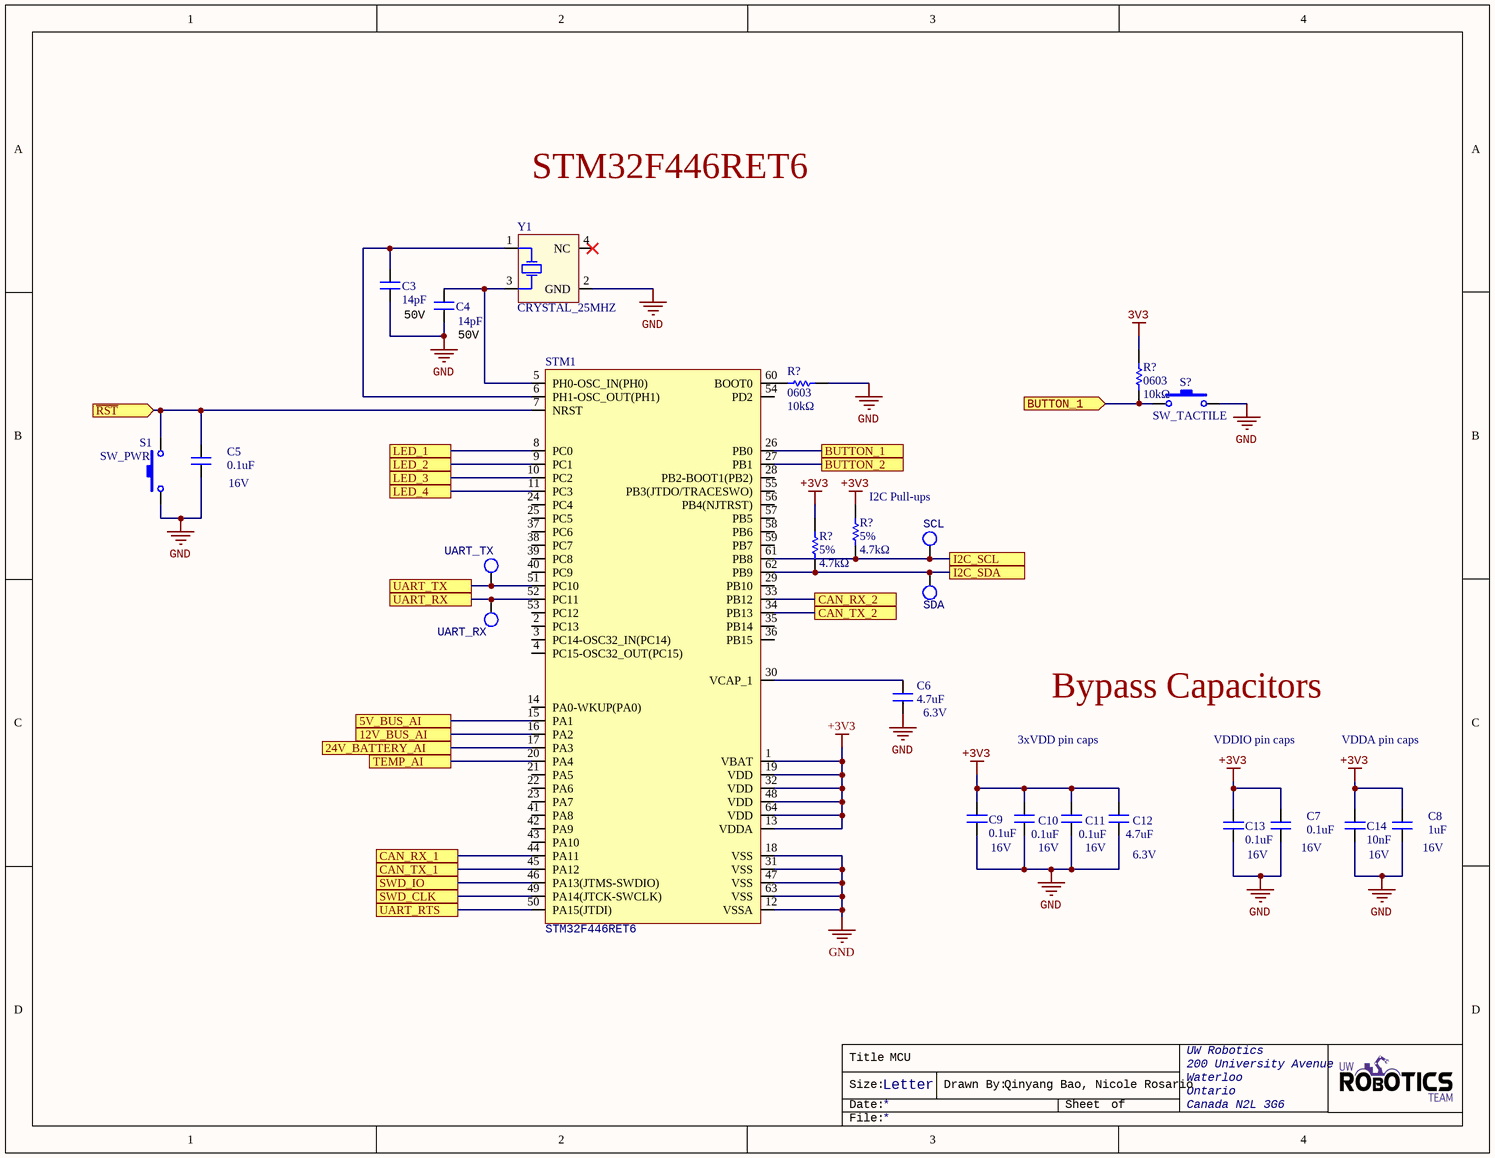
[diagram p4: SH5 - MICROCONTROLLER.SchDoc]

### Parts
(Parts that share a designator on the sheet are numbered #1, #2 ... from top to bottom, then left to right.)
C3  value 14pF  Voltage Rating: 50V  [CAPC0603(1608)55_N]  (hidden comment: CL10C140JB8NNNC)
C4  value 14pF  Voltage Rating: 50V  [CAPC0603(1608)55_N]  (hidden comment: CL10C140JB8NNNC)
C5  value 0.1uF  Voltage Rating: 16V  [CAPC0603(1608)55_N]  (hidden comment: CAP_0.1uF_16V_0603)
C6  value 4.7uF  Voltage Rating: 6.3V  [CAPC0603(1608)55_N]  (hidden comment: CAP_4.7uF_0603)
C7  value 0.1uF  Voltage Rating: 16V  [CAPC0603(1608)55_N]  (hidden comment: CAP_0.1uF_16V_0603)
C8  value 1uF  Voltage Rating: 16V  [CAPC0603(1608)55_N]  (hidden comment: CAP_1uF_16V_0603)
C9  value 0.1uF  Voltage Rating: 16V  [CAPC0603(1608)55_N]  (hidden comment: CAP_0.1uF_16V_0603)
C10  value 0.1uF  Voltage Rating: 16V  [CAPC0603(1608)55_N]  (hidden comment: CAP_0.1uF_16V_0603)
C11  value 0.1uF  Voltage Rating: 16V  [CAPC0603(1608)55_N]  (hidden comment: CAP_0.1uF_16V_0603)
C12  value 4.7uF  Voltage Rating: 6.3V  [CAPC0603(1608)55_N]  (hidden comment: CAP_4.7uF_0603)
C13  value 0.1uF  Voltage Rating: 16V  [CAPC0603(1608)55_N]  (hidden comment: CAP_0.1uF_16V_0603)
C14  value 10nF  Voltage Rating: 16V  [CAPC0603(1608)55_N]  (hidden comment: CAP_10nF_0603)
R?#14  value 10kΩ  Case Code (Imperial): 0603  [RESC0603(1608)_N]  (hidden comment: RES_10kΩ_0603)
R?#15  value 10kΩ  Case Code (Imperial): 0603  [RESC0603(1608)_N]  (hidden comment: RES_10kΩ_0603)
R?#16  value 4.7kΩ  Tolerance: 5%  [RESC0603(1608)_N]  (hidden comment: RES_4.7kΩ_0603)
R?#17  value 4.7kΩ  Tolerance: 5%  [RESC0603(1608)_N]  (hidden comment: RES_4.7kΩ_0603)
S1  SW_PWR  [PTS830GM140]
S?  SW_TACTILE  [B3U-1100P]
SCL  TESTPOINT_LOOP  [TESTPOINT_LOOP]  (value not drawn)
SDA  TESTPOINT_LOOP  [TESTPOINT_LOOP]  (value not drawn)
STM1  STM32F446RET6  [STM-LQFP64_L]
UART_RX  TESTPOINT_LOOP  [TESTPOINT_LOOP]  (value not drawn)
UART_TX  TESTPOINT_LOOP  [TESTPOINT_LOOP]  (value not drawn)
Y1  CRYSTAL_25MHZ  [AVX-CX2520DB32000D0GEJZ1-4_V]

### Ports
5V_BUS_AI, 12V_BUS_AI, 24V_BATTERY_AI, BUTTON_1, BUTTON_1 (in), BUTTON_2, CAN_RX_1, CAN_RX_2, CAN_TX_1, CAN_TX_2, I2C_SCL, I2C_SDA, LED_1, LED_2, LED_3, LED_4, SWD_CLK, SWD_IO, TEMP_AI, UART_RTS, UART_RX, UART_TX, ~{RST} (in)

### Nets
3V3: R?#14.2
+3V3: C7.2 C8.2 C9.2 C10.2 C11.2 C12.2 C13.2 C14.2 R?#16.2 R?#17.2 STM1.1(VBAT) STM1.13(VDDA) STM1.19(VDD) STM1.32(VDD) STM1.48(VDD) STM1.64(VDD)
GND: C3.1 C4.1 C5.1 C6.1 C7.1 C8.1 C9.1 C10.1 C11.1 C12.1 C13.1 C14.1 R?#15.2 S1.1 S?.2 STM1.12(VSSA) STM1.18(VSS) STM1.31(VSS) STM1.47(VSS) STM1.63(VSS) Y1.2(GND)
NetBAT_V_1: STM1.17(PA3) ; port 24V_BATTERY_AI
NetBOARDS_V_1: STM1.15(PA1) ; port 5V_BUS_AI
NetC3_2: C3.2 STM1.6(PH1-OSC_OUT(PH1)) Y1.1(HOT)
NetC4_2: C4.2 STM1.5(PH0-OSC_IN(PH0)) Y1.3(HOT)
NetC5_2: C5.2 S1.2 STM1.7(NRST) ; port ~{RST}
NetC6_2: C6.2 STM1.30(VCAP_1)
NetJ?_2: STM1.51(PC10) UART_TX.1 ; port UART_TX
NetJ?_3: STM1.52(PC11) UART_RX.1 ; port UART_RX
NetJ?_4: STM1.50(PA15(JTDI)) ; port UART_RTS
NetJ?_6: STM1.46(PA13(JTMS-SWDIO)) ; port SWD_IO
NetJ?_7: STM1.49(PA14(JTCK-SWCLK)) ; port SWD_CLK
NetMOTOR_V_1: STM1.16(PA2) ; port 12V_BUS_AI
NetR?#14_1: R?#14.1 S?.1 STM1.26(PB0) ; port BUTTON_1
NetR?#15_1: R?#15.1 STM1.60(BOOT0)
NetR?#16_1: R?#16.1 SCL.1 STM1.61(PB8) ; port I2C_SCL
NetR?#17_1: R?#17.1 SDA.1 STM1.62(PB9) ; port I2C_SDA
NetSTM1_8: STM1.8(PC0) ; port LED_1
NetSTM1_9: STM1.9(PC1) ; port LED_2
NetSTM1_10: STM1.10(PC2) ; port LED_3
NetSTM1_11: STM1.11(PC3) ; port LED_4
NetSTM1_20: STM1.20(PA4) ; port TEMP_AI
NetSTM1_27: STM1.27(PB1) ; port BUTTON_2
NetSTM1_33: STM1.33(PB12) ; port CAN_RX_2
NetSTM1_34: STM1.34(PB13) ; port CAN_TX_2
NetSTM1_44: STM1.44(PA11) ; port CAN_RX_1
NetSTM1_45: STM1.45(PA12) ; port CAN_TX_1

Not connected (* = marked no-connect by the designer): STM1 2(PC13) 3(PC14-OSC32_IN(PC14)) 4(PC15-OSC32_OUT(PC15)) 14(PA0-WKUP(PA0)) 21(PA5) 22(PA6) 23(PA7) 24(PC4) 25(PC5) 28(PB2-BOOT1(PB2)) 29(PB10) 35(PB14) 36(PB15) 37(PC6) 38(PC7) 39(PC8) 40(PC9) 41(PA8) 42(PA9) 43(PA10) 53(PC12) 54(PD2) 55(PB3(JTDO/TRACESWO)) 56(PB4(NJTRST)) 57(PB5) 58(PB6) 59(PB7); Y1 4(NC)*

### Notes on the sheet
- STM32F446RET6
- (near R?#16) I2C Pull-ups
- Bypass Capacitors
- 3xVDD pin caps
- VDDIO pin caps
- VDDA pin caps
- Title
- Size:
- Date:
- Letter
- Drawn By:
- Sheet
- of
- File:

### Library data of the parts
C3 C4 = CL10C140JB8NNNC: Cap Ceramic 14pF 50V C0G 5% SMD 0603 125C Cardboard T/R; Manufacturer 1: Samsung; Supplier Part Number 1: 1276-2187-1-ND; Supplier 1: Digi-Key; Manufacturer Part Number 1: CL10C140JB8NNNC; Stock 1: 187088; Pricing 1: 1=0.10000, 10=0.06700, 100=0.02980, 500=0.02130, 1000=0.01673 (USD); RoHS: Yes; Mount: Surface Mount; Case/Package: 0603; Case Code (Metric): 1608; Case Code (Imperial): 0603; Min Operating Temperature: -55°C; Max Operating Temperature: 125°C; Tolerance: 5%; Package Quantity: 1; Packaging: Tape and Reel; Voltage Rating (DC): 50V; Dielectric: C0G; Length: 1.6mm; Height: 0.8mm; Width: 0.031inch; Depth: 0.8mm; Thickness: 0.035inch; Radiation Hardening: No; ComponentLink1URL: https://datasheet.ciiva.com/25782/cl10c140jb8nnnc-25782947.pdf?src-supplier=Digi-Key; ComponentLink1Description: https://datasheet.ciiva.com/25782/cl10c140jb8nnnc-25782947.pdf?src-supplier=Digi-Key; Capacitance: 14pF
C5 C7 C9-C11 C13 = CAP_0.1uF_16V_0603: CAP CER 0.1UF 16V X7R 0603; Manufacturer: Yageo; MPN: CC0603KRX7R7BB104; Dimensions: 0.063" L x 0.031" W (1.60mm x 0.80mm); Package: 0603 (1608 Metric); Temperature Coefficient: X7R; Supplier Part Number 1: 311-1088-1-ND; Supplier 1: Digi-Key
C6 C12 = CAP_4.7uF_0603: CAP CER 4.7UF 6.3V X5R 0603; Manufacturer: Yageo; MPN: CC0603KRX5R5BB475; Dimensions: 0.063" L x 0.031" W (1.60mm x 0.80mm); Package: 0603 (1608 Metric); Temperature Coefficient: X5R; Supplier Part Number 1: 311-1521-1-ND; Supplier 1: Digi-Key
C8 = CAP_1uF_16V_0603: CAP CER 1UF 16V Y5V 0603; Manufacturer: Yageo; MPN: CC0603ZRY5V7BB105; Dimensions: 0.063" L x 0.031" W (1.60mm x 0.80mm); Package: 0603 (1608 Metric); Temperature Coefficient: Y5V; Supplier Part Number 1: 311-1372-1-ND; Supplier 1: Digi-Key
C14 = CAP_10nF_0603: CAP CER 10000PF 16V X7R 0603; Manufacturer: Yageo; MPN: CC0603KRX7R7BB103; Dimensions: 0.063" L x 0.031" W (1.60mm x 0.80mm); Package: 0603 (1608 Metric); Temperature Coefficient: X7R; Supplier Part Number 1: 311-3369-1-ND; Supplier 1: Digi-Key
R?#14 R?#15 = RES_10kΩ_0603: as R?#3 on sheet SH3 - OPAMPS; Package: 0603 (1608 Metric); Dimensions: 0.063" L x 0.031" W (1.60mm x 0.80mm); Supplier Part Number 1: 311-10KGRCT-ND; Supplier 1: Digi-Key; Mount: Surface Mount; Case Code (Metric): 1608; Tolerance: 5%
R?#16 R?#17 = RES_4.7kΩ_0603: RES SMD 4.7K OHM 5% 1/10W 0603; Manufacturer 1: Yageo; Manufacturer Part Number 1: RC0603JR-074K7L; Package: 0603 (1608 Metric); Dimensions: 0.063" L x 0.031" W (1.60mm x 0.80mm); Supplier Part Number 1: 311-4.7KGRCT-ND; Supplier 1: Digi-Key; Mount: Surface Mount; Case Code (Metric): 1608; Case Code (Imperial): 0603
S1 = SW_PWR: Power Switch (Red); pin to pad: 2>4; MPN: PTS830GM140 SMTR LFS; Manufacturer: C&K; ComponentLink1Description: Datasheet; ComponentLink1URL: https://www.ckswitches.com/media/1478/pts830.pdf; Supplier Part Number 1: CKN10587CT-ND; Supplier 1: Digi-Key
S? = SW_TACTILE: Tactile Switch (Grey); Manufacturer: Omron Electronics Inc-EMC Div; MPN: B3U-1100P; Supplier 1: Digi-Key
SCL SDA UART_RX UART_TX = TESTPOINT_LOOP: as TP?#1 on sheet SH2 - CONNECTORS; Supplier Part Number 1: 36-5002-ND; Supplier 1: Digi-Key
STM1 = MCU_STM32F446RET6: ARM Cortex-M4 32-bit MCU+FPU, 512 KB Flash, 128 KB Internal RAM, 50 I/Os, 64-Pin LQFP, -40 to 85 degC, Tray; I/Os (High Current): 50; Supply Voltage(Vcc) min (V): 1.7; Operating Frequency(F) (Processor speed) (MHz): 180; D/A Converter: 2; Internal RAM Size (kB): 128; FLASH Size (Prog) (kB): 512; Core: ARM Cortex-M4; ComponentLink1Description: Manufacturer URL; Package Reference: 64-Pin Low-profile Quad Flat Package, Body 10 x 10 mm, Pitch 0.5 mm; ComponentLink2URL: http://www.st.com/st-web-ui/static/active/en/resource/technical/document/datasheet/DM00141306.pdf; Packing: Tray; DatasheetVersion: Rev. 6; ComponentLink1URL: http://www.st.com/; ComponentLink2Description: Datasheet; Package Description: LQFP64; Mounting Technology: Surface Mount; Supplier Part Number 1: 497-15376-ND; Supplier 1: Digi-Key
Y1 = CRYSTAL_25MHZ: CRYSTAL 25.0000MHZ 12PF SMD; Manufacturer 1: Kyocera AVX; Manufacturer Part Number 1: CX2520DB25000H0FLJC1; Frequency: 25MHz; ESR (Equivalent Series Resistance): 80R; Frequency Stability: 15ppm; Frequency Tolerance: 10ppm; ComponentLink1Description: https://media.digikey.com/pdf/Data%20Sheets/AVX%20PDFs/CX2520DB_USY1M-H1-16429-00_Spec.pdf?src-supplier=Digi-Key; ComponentLink1URL: https://media.digikey.com/pdf/Data%20Sheets/AVX%20PDFs/CX2520DB_USY1M-H1-16429-00_Spec.pdf?src-supplier=Digi-Key; Supplier 1: Digi-Key; Supplier Part Number 1: 1253-1724-1-ND; Stock 1: 11741; Pricing 1: 1=0.72000, 10=0.63300, 50=0.59120, 100=0.52250, 500=0.49500, 1000=0.41250 (USD); RoHS: Yes; Mount: Surface Mount; Case/Package: SMD/SMT; Min Operating Temperature: -30°C; Max Operating Temperature: 85°C; Packaging: Tape and Reel; Load Capacitance: 12pF; Length: 0.098inch; Height: 0.022inch; Width: 0.079inch; Ratings: AEC-Q200

## Sheet SH6 - CAN.SchDoc: CAN
size Letter; DrawnBy: Qinyang Bao, Nicole Rosario; Organization: UW Robotics; Address1: 200 University Avenue; Address2: Waterloo; Address3: Ontario; Address4: Canada N2L 3G6
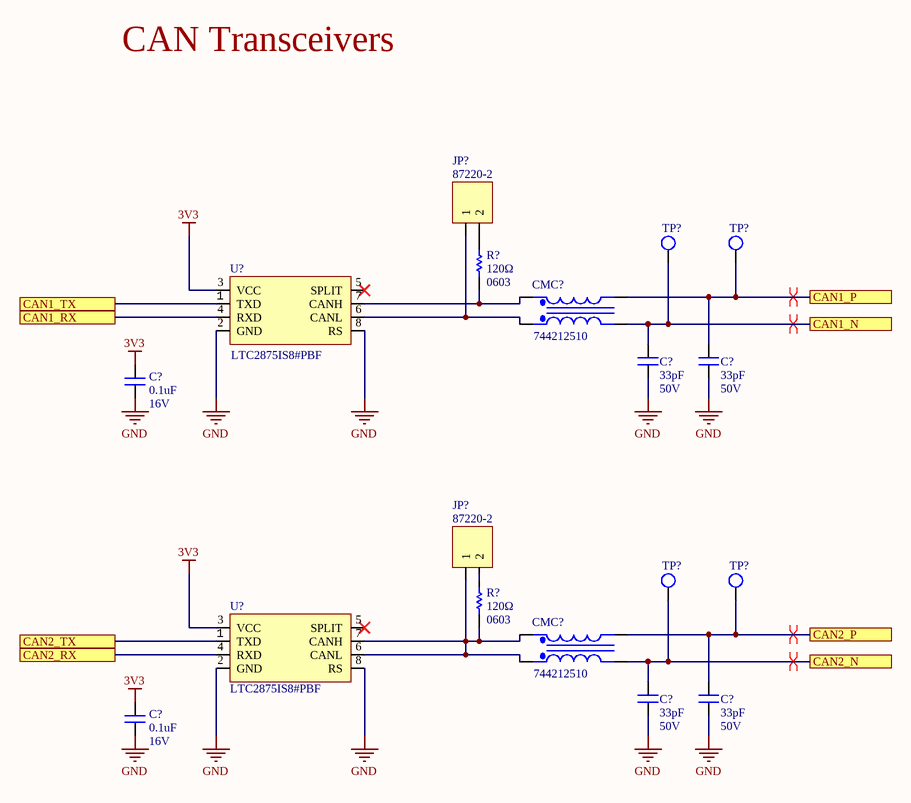
[diagram p5: SH6 - CAN.SchDoc]

### Parts
(Parts that share a designator on the sheet are numbered #1, #2 ... from top to bottom, then left to right.)
C?#3  value 33pF  Voltage: 50V  [CAPC0603(1608)55_N]  (hidden comment: CAP_33pF_50V_0603)
C?#4  value 33pF  Voltage: 50V  [CAPC0603(1608)55_N]  (hidden comment: CAP_33pF_50V_0603)
C?#5  value 0.1uF  Voltage Rating: 16V  [CAPC0603(1608)55_N]  (hidden comment: CAP_0.1uF_16V_0603)
C?#6  value 33pF  Voltage: 50V  [CAPC0603(1608)55_N]  (hidden comment: CAP_33pF_50V_0603)
C?#7  value 33pF  Voltage: 50V  [CAPC0603(1608)55_N]  (hidden comment: CAP_33pF_50V_0603)
C?#8  value 0.1uF  Voltage Rating: 16V  [CAPC0603(1608)55_N]  (hidden comment: CAP_0.1uF_16V_0603)
CMC?#1  CMC_51uH  [744212510]  (value not drawn)
CMC?#2  CMC_51uH  [744212510]  (value not drawn)
JP?#1  Manufacturer Part Number 1: 87220-2  [HDR1X2]  (hidden comment: JUMPER_2)
JP?#2  Manufacturer Part Number 1: 87220-2  [HDR1X2]  (hidden comment: JUMPER_2)
R?#18  value 120Ω  Case Code (Imperial): 0603  [RESC0603(1608)_N]  (hidden comment: RES_120Ω_0603)
R?#19  value 120Ω  Case Code (Imperial): 0603  [RESC0603(1608)_N]  (hidden comment: RES_120Ω_0603)
TP?#3  TESTPOINT_LOOP  [TESTPOINT_LOOP]  (value not drawn)
TP?#4  TESTPOINT_LOOP  [TESTPOINT_LOOP]  (value not drawn)
TP?#5  TESTPOINT_LOOP  [TESTPOINT_LOOP]  (value not drawn)
TP?#6  TESTPOINT_LOOP  [TESTPOINT_LOOP]  (value not drawn)
U?#2  Manufacturer Part Number 1: LTC2875IS8#PBF  [LT-S8_N]  (hidden comment: IC TXRX CAN)
U?#3  Manufacturer Part Number 1: LTC2875IS8#PBF  [LT-S8_N]  (hidden comment: IC TXRX CAN)

### Ports
CAN1_N, CAN1_P, CAN1_RX, CAN1_TX, CAN2_N, CAN2_P, CAN2_RX, CAN2_TX

### Nets
3V3: C?#5.1 C?#8.1 U?#2.3(VCC) U?#3.3(VCC)
GND: C?#3.1 C?#4.1 C?#5.2 C?#6.1 C?#7.1 C?#8.2 U?#2.2(GND) U?#2.8(RS) U?#3.2(GND) U?#3.8(RS)
NetC?#3_2: C?#3.2 CMC?#1.5(Pri-) TP?#3.1 ; port CAN1_N
NetC?#4_2: C?#4.2 CMC?#1.4(Sec-) TP?#4.1 ; port CAN1_P
NetC?#6_2: C?#6.2 CMC?#2.5(Pri-) TP?#5.1 ; port CAN2_N
NetC?#7_2: C?#7.2 CMC?#2.4(Sec-) TP?#6.1 ; port CAN2_P
NetCMC?#1_1: CMC?#1.1(Pri+) JP?#1.1 U?#2.6(CANL)
NetCMC?#1_3: CMC?#1.3(Sec+) R?#18.1 U?#2.7(CANH)
NetCMC?#2_1: CMC?#2.1(Pri+) CMC?#2.3(Sec+) JP?#2.1 R?#19.1 U?#3.6(CANL) U?#3.7(CANH)
NetJP?#1_2: JP?#1.2 R?#18.2
NetJP?#2_2: JP?#2.2 R?#19.2
NetU?#2_1: U?#2.1(TXD) ; port CAN1_TX
NetU?#2_4: U?#2.4(RXD) ; port CAN1_RX
NetU?#3_1: U?#3.1(TXD) ; port CAN2_TX
NetU?#3_4: U?#3.4(RXD) ; port CAN2_RX

Not connected (* = marked no-connect by the designer): U?#2 5(SPLIT)*; U?#3 5(SPLIT)*

### Layout directives
differential pair: NetC?#3_2, NetC?#4_2, NetC?#6_2, NetC?#7_2

### Notes on the sheet
- CAN Transceivers
- Title
- Size:
- Date:
- Letter
- Drawn By:
- Sheet
- of
- File:

### Library data of the parts
C?#3 C?#4 C?#6 C?#7 = CAP_33pF_50V_0603: CAP CER 33PF 50V C0G/NP0; Manufacturer 1: Yageo; Manufacturer Part Number 1: CC0603JRNPO9BN330; Dielectric Material: Ceramic; Temperature Coefficient: 30ppm/°C; Tolerance: 5%; Dielectric: C0G, NP0; Insulation Resistance: 100GR; Supplier 1: Digi-Key; Mount: Surface Mount; Number of Pins: 2; Case Code (Metric): 1608; Min Operating Temperature: -55°C; Max Operating Temperature: 125°C; Termination: SMD/SMT; Composition: Ceramic; Voltage Rating: 50V; Voltage Rating (DC): 50V; Length: 1.6mm; Height: 0.8mm; Thickness: 0.035inch; Depth: 0.8mm; Width: 0.031inch; REACH SVHC: No SVHC; ComponentLink7URL: https://datasheet.ciiva.com/11464/upy-gp-np0-16v-to-50v-8-11464730.pdf?src-supplier=Avnet; ComponentLink7Description: https://datasheet.ciiva.com/11464/upy-gp-np0-16v-to-50v-8-11464730.pdf?src-supplier=Avnet; ComponentLink8URL: https://datasheet.ciiva.com/46430/1835847-46430155.pdf?src-supplier=Element14; ComponentLink8Description: https://datasheet.ciiva.com/46430/1835847-46430155.pdf?src-supplier=Element14; ComponentLink9URL: https://datasheet.ciiva.com/144/mlccorderingcode-144644.pdf?src-supplier=Digi-Key; ComponentLink9Description: https://datasheet.ciiva.com/144/mlccorderingcode-144644.pdf?src-supplier=Digi-Key; ComponentLink10URL: https://datasheet.ciiva.com/5426/upy-gp-np0-16v-to-50v-8-5426614.pdf?src-supplier=Mouser; ComponentLink10Description: https://datasheet.ciiva.com/5426/upy-gp-np0-16v-to-50v-8-5426614.pdf?src-supplier=Mouser; ComponentLink11URL: https://datasheet.ciiva.com/7978/1443161-7978142.pdf?src-supplier=Element14; ComponentLink11Description: https://datasheet.ciiva.com/7978/1443161-7978142.pdf?src-supplier=Element14; Supplier Part Number 1: 311-1064-1-ND; Package: 0603; Case Code (Imperial): 0603
C?#5 C?#8 = CAP_0.1uF_16V_0603: CAP CER 0.1UF 16V X7R 0603; Manufacturer Part Number 1: CC0603KRX7R7BB104; Manufacturer 1: Yageo; Dimensions: 0.063" L x 0.031" W (1.60mm x 0.80mm); Package: 0603 (1608 Metric); Temperature Coefficient: X7R; Supplier Part Number 1: 311-1088-1-ND; Supplier 1: Digi-Key; Mount: Surface Mount
CMC?#1 CMC?#2 = CMC_51uH: CMC 51uH 300MA 2LN SMD; Manufacturer 1: Wurth Electronics; Core Material: Ferrite; DC Resistance (DCR): 160mR; Test Frequency: 100kHz; Inductance Tolerance: 50%; Voltage Rating (DC): 80V; Number of Lines: 2; Impedance: 300R; Supplier 1: Digi-Key; Manufacturer Part Number 1: 744212510; Stock 1: 1070; Pricing 1: 1=4.22000, 10=4.16600, 50=3.76300, 100=3.62900, 500=3.36000 (USD); RoHS: Yes; Mount: Surface Mount; Case/Package: SMD/SMT; Number of Pins: 4; Min Operating Temperature: -40°C; Max Operating Temperature: 105°C; Current: 300mA; Max DC Current: 300mA; Termination: SMD/SMT; Current Rating: 300mA; Inductance: 51uH; Tolerance: 50%; Package Quantity: 1000; Packaging: Tape and Reel; Length: 6.5mm; Height: 1.65mm; Depth: 3.6mm; Width: 0.142inch; REACH SVHC: No SVHC; Lead Free: Lead Free; ComponentLink1URL: https://datasheet.ciiva.com/11800/0900766b8059564e-11800467.pdf?src-supplier=RSComponents; ComponentLink1Description: https://datasheet.ciiva.com/11800/0900766b8059564e-11800467.pdf?src-supplier=RSComponents; ComponentLink2URL: https://datasheet.ciiva.com/1130/744212510-1130407.pdf?src-supplier=Newark; ComponentLink2Description: https://datasheet.ciiva.com/1130/744212510-1130407.pdf?src-supplier=Newark; ComponentLink3URL: https://datasheet.ciiva.com/6048/1735560-6048484.pdf?src-supplier=Farnell; ComponentLink3Description: https://datasheet.ciiva.com/6048/1735560-6048484.pdf?src-supplier=Farnell; ComponentLink4URL: https://datasheet.ciiva.com/4952/744212510-77598-4952687.pdf?src-supplier=Mouser; ComponentLink4Description: https://datasheet.ciiva.com/4952/744212510-77598-4952687.pdf?src-supplier=Mouser; ComponentLink5URL: https://datasheet.ciiva.com/6216/744212510-6216346.pdf?src-supplier=Digi-Key; ComponentLink5Description: https://datasheet.ciiva.com/6216/744212510-6216346.pdf?src-supplier=Digi-Key; ComponentLink6URL: https://datasheet.ciiva.com/22705/1735560-22705131.pdf?src-supplier=Element14; ComponentLink6Description: https://datasheet.ciiva.com/22705/1735560-22705131.pdf?src-supplier=Element14; ComponentLink7URL: https://datasheet.ciiva.com/6216/744212510-6216348.pdf?src-supplier=Digi-Key; ComponentLink7Description: https://datasheet.ciiva.com/6216/744212510-6216348.pdf?src-supplier=Digi-Key; ComponentLink8URL: https://datasheet.ciiva.com/7764/1735560-7764951.pdf?src-supplier=Element14; ComponentLink8Description: https://datasheet.ciiva.com/7764/1735560-7764951.pdf?src-supplier=Element14; Supplier Part Number 1: 732-3941-1-ND
JP?#1 JP?#2 = JUMPER_2: as J5 on sheet SH4 - DIFFERENTIAL I2C; Supplier 1: Digi-Key; Supplier Part Number 1: A26542-ND; Mount: Through Hole
R?#18 R?#19 = RES_120Ω_0603: RES SMD 120 OHM 5% 1/10W 0603; Manufacturer 1: Yageo; Manufacturer Part Number 1: RC0603JR-07120RL; Package: 0603 (1608 Metric); Dimensions: 0.063" L x 0.031" W (1.60mm x 0.80mm); Supplier Part Number 1: 311-120GRCT-ND; Supplier 1: Digi-Key; Mount: Surface Mount; Case Code (Metric): 1608; Tolerance: 5%
TP?#3-TP?#6 = TESTPOINT_LOOP: as TP1 on sheet SH4 - DIFFERENTIAL I2C; Supplier Part Number 1: 36-5002-ND; Supplier 1: Digi-Key; Mount: Through Hole
U?#2 U?#3 = LTC2875: IC TXRX CAN 4MBPS 8SO; Manufacturer 1: Linear Technologies; Package: 8-SOIC (0.154", 3.90mm Width); ComponentLink1Description: Datasheet; ComponentLink1URL: https://www.analog.com/media/en/technical-documentation/data-sheets/2875f.pdf; Supplier Part Number 1: LTC2875IS8#PBF-ND; Supplier 1: Digi-Key; Mount: Surface Mount

## Nets that join several sheets
3V3: SH1 - POWER (C?#1.2 L?.2 R?#1.2), SH2 - CONNECTORS (J2.1 J?.1), SH3 - OPAMPS (8 pins), SH4 - DIFFERENTIAL I2C (5 pins), SH5 - MICROCONTROLLER (R?#14.2), SH6 - CAN (C?#5.1 C?#8.1 U?#2.3 U?#3.3)
5V0: SH1 - POWER (C?#2.2 U?#1.3 U?#1.5), SH2 - CONNECTORS (F1.2), SH3 - OPAMPS (R?#6.1 TH1.2)
GND: SH1 - POWER (C?#1.1 C?#2.1 R?#2.1 U?#1.2), SH2 - CONNECTORS (18 pins), SH3 - OPAMPS (17 pins), SH4 - DIFFERENTIAL I2C (C25.1 J10.2 U7.5), SH5 - MICROCONTROLLER (21 pins), SH6 - CAN (10 pins)
BIAS_GND: SH2 - CONNECTORS (J2.3), SH4 - DIFFERENTIAL I2C (5 pins)
DSCL_N: SH2 - CONNECTORS (J2.5), SH4 - DIFFERENTIAL I2C (J6.2 R?#13.2 TP4.1 U7.6)
DSCL_P: SH2 - CONNECTORS (J2.4), SH4 - DIFFERENTIAL I2C (R?#11.1 R?#12.2 TP3.1 U7.7)
DSDA_P: SH2 - CONNECTORS (J2.2), SH4 - DIFFERENTIAL I2C (R?#9.1 R?#10.2 TP1.1 U7.8)
NetBAT_V_1: SH3 - OPAMPS (BAT_V.1 U6.1 U6.4), SH5 - MICROCONTROLLER (STM1.17)
NetBOARDS_V_1: SH3 - OPAMPS (BOARDS_V.1 U5.1 U5.4), SH5 - MICROCONTROLLER (STM1.15)
NetC5_2: SH2 - CONNECTORS (J?.8), SH5 - MICROCONTROLLER (C5.2 S1.2 STM1.7)
NetC?#3_2: SH2 - CONNECTORS (D2.1 D4.1 J3.2 J4.2), SH6 - CAN (C?#3.2 CMC?#1.5 TP?#3.1)
NetC?#4_2: SH2 - CONNECTORS (D2.2 D4.2 J3.1 J4.1), SH6 - CAN (C?#4.2 CMC?#1.4 TP?#4.1)
NetC?#6_2: SH2 - CONNECTORS (D3.1 D5.1 J3.4 J4.4), SH6 - CAN (C?#6.2 CMC?#2.5 TP?#5.1)
NetC?#7_2: SH2 - CONNECTORS (D3.2 D5.2 J3.3 J4.3), SH6 - CAN (C?#7.2 CMC?#2.4 TP?#6.1)
NetJ8_1: SH2 - CONNECTORS (J8.1 TP?#1.1), SH3 - OPAMPS (R?#3.2)
NetJ9_1: SH2 - CONNECTORS (J9.1 TP?#2.1), SH3 - OPAMPS (R?#5.2)
NetJ?_2: SH2 - CONNECTORS (J?.2), SH5 - MICROCONTROLLER (STM1.51 UART_TX.1)
NetJ?_3: SH2 - CONNECTORS (J?.3), SH5 - MICROCONTROLLER (STM1.52 UART_RX.1)
NetJ?_4: SH2 - CONNECTORS (J?.4), SH5 - MICROCONTROLLER (STM1.50)
NetJ?_6: SH2 - CONNECTORS (J?.6), SH5 - MICROCONTROLLER (STM1.46)
NetJ?_7: SH2 - CONNECTORS (J?.7), SH5 - MICROCONTROLLER (STM1.49)
NetMOTOR_V_1: SH3 - OPAMPS (MOTOR_V.1 U3.1 U3.4), SH5 - MICROCONTROLLER (STM1.16)
NetSTM1_20: SH3 - OPAMPS (TEMP.1 U4.1 U4.4), SH5 - MICROCONTROLLER (STM1.20)